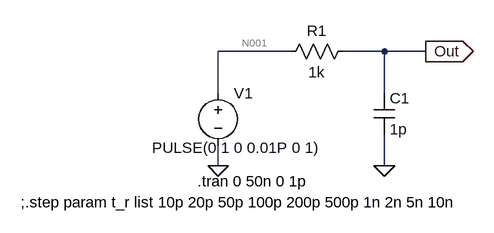
[diagram p0: schematic Q5.asc]
Q5.asc, the LTspice schematic file:
Version 4
SHEET 1 880 680
WIRE 224 80 112 80
WIRE 368 80 304 80
WIRE 432 80 368 80
WIRE 112 144 112 80
WIRE 368 144 368 80
WIRE 112 256 112 224
WIRE 368 256 368 208
FLAG 112 256 0
FLAG 368 256 0
FLAG 432 80 Out
IOPIN 432 80 Out
SYMBOL voltage 112 128 R0
WINDOW 123 0 0 Left 0
WINDOW 39 0 0 Left 0
WINDOW 3 -102 100 Left 2
SYMATTR Value PULSE(0 1 0 0.01P 0 1)
SYMATTR InstName V1
SYMBOL res 320 64 R90
WINDOW 0 0 56 VBottom 2
WINDOW 3 32 56 VTop 2
SYMATTR InstName R1
SYMATTR Value 1k
SYMBOL cap 352 144 R0
SYMATTR InstName C1
SYMATTR Value 1p
TEXT 80 280 Left 2 !.tran 0 50n 0 1p
TEXT -192 312 Left 2 !;.step param t_r list 10p 20p 50p 100p 200p 500p 1n 2n 5n 10n

The netlist it stands for:
* Q5.asc
V1 N001 0 PULSE(0 1 0 0.01P 0 1)
R1 Out N001 1k
C1 Out 0 1p
.tran 0 50n 0 1p
;.step param t_r list 10p 20p 50p 100p 200p 500p 1n 2n 5n 10n
.backanno
.end

* Results of the author's LTspice run, read from the files saved beside the schematic
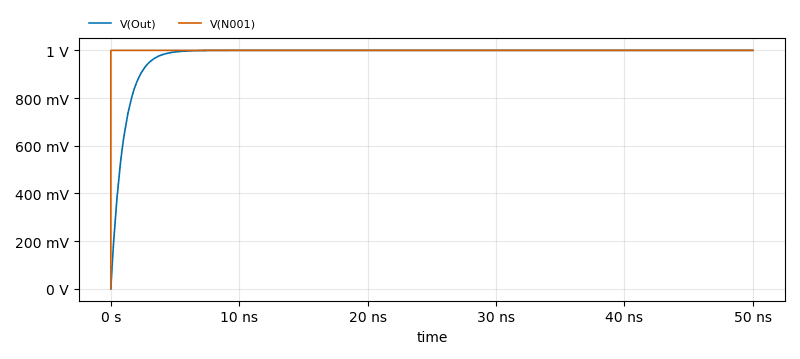
[diagram p1: Transient Analysis of Q5.asc, plotted from the saved traces]
* Transient Analysis, 1 run:
*   V(Out): min 0 V, max 1 V, average 979.9 mV, rms 984.9 mV, last 1 V
*   V(N001): min 0 V, max 1 V, average 1 V, rms 1 V, last 1 V